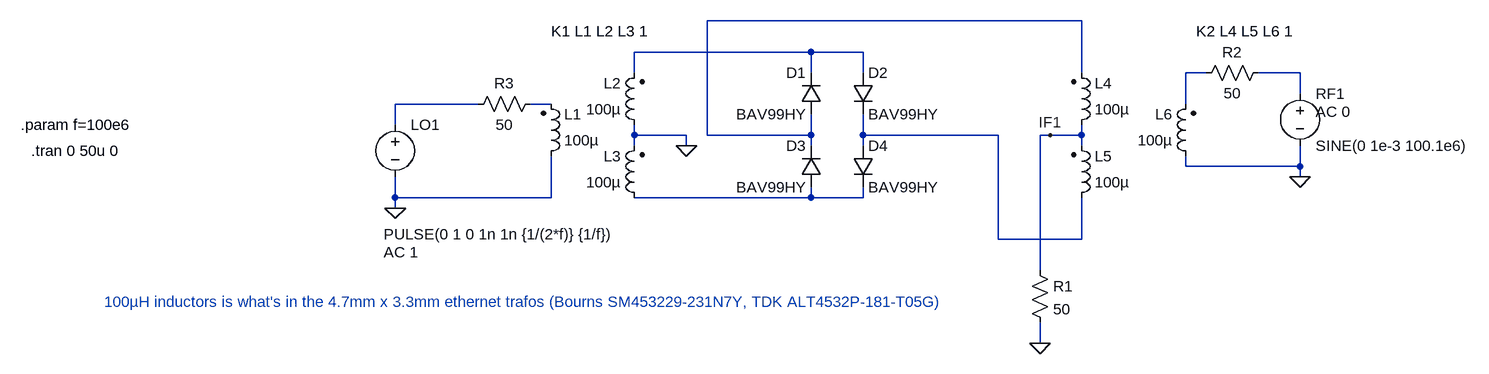
[diagram p0: schematic ethernet_mixer.asc]
ethernet_mixer.asc, the LTspice schematic file:
Version 4
SHEET 1 1112 680
WIRE 496 -320 -80 -320
WIRE 80 -272 -192 -272
WIRE 160 -272 80 -272
WIRE -192 -240 -192 -272
WIRE 80 -240 80 -272
WIRE 160 -240 160 -272
WIRE 496 -240 496 -320
WIRE 688 -240 656 -240
WIRE 832 -240 768 -240
WIRE 832 -208 832 -240
WIRE -432 -192 -560 -192
WIRE -320 -192 -352 -192
WIRE 656 -192 656 -240
WIRE -560 -160 -560 -192
WIRE -192 -144 -192 -160
WIRE -112 -144 -192 -144
WIRE -80 -144 -80 -320
WIRE 80 -144 80 -176
WIRE 80 -144 -80 -144
WIRE 160 -144 160 -176
WIRE 368 -144 160 -144
WIRE 448 -144 432 -144
WIRE 496 -144 496 -160
WIRE 496 -144 448 -144
WIRE -192 -128 -192 -144
WIRE -112 -128 -112 -144
WIRE 80 -128 80 -144
WIRE 160 -128 160 -144
WIRE 496 -128 496 -144
WIRE 656 -96 656 -112
WIRE 832 -96 832 -128
WIRE 832 -96 656 -96
WIRE 832 -80 832 -96
WIRE -560 -48 -560 -80
WIRE -320 -48 -320 -112
WIRE -320 -48 -560 -48
WIRE 80 -48 80 -64
WIRE 80 -48 -192 -48
WIRE 160 -48 160 -64
WIRE 160 -48 80 -48
WIRE -560 -32 -560 -48
WIRE 368 16 368 -144
WIRE 496 16 496 -48
WIRE 496 16 368 16
WIRE 432 64 432 -144
WIRE 432 176 432 144
FLAG -112 -128 0
FLAG -560 -32 0
FLAG 832 -80 0
FLAG 432 176 0
FLAG 448 -144 IF1
SYMBOL voltage -560 -176 R0
WINDOW 3 -18 184 Left 2
WINDOW 123 -18 212 Left 2
WINDOW 39 0 0 Left 0
SYMATTR Value PULSE(0 1 0 1n 1n {1/(2*f)} {1/f})
SYMATTR Value2 AC 1
SYMATTR InstName LO1
SYMBOL ind2 -336 -96 M180
WINDOW 0 36 80 Left 2
WINDOW 3 36 40 Left 2
SYMATTR InstName L1
SYMATTR Value 100µ
SYMATTR Type ind
SYMBOL ind2 -176 -144 R180
WINDOW 0 36 80 Left 2
WINDOW 3 36 40 Left 2
SYMATTR InstName L2
SYMATTR Value 100µ
SYMATTR Type ind
SYMBOL ind2 -176 -32 R180
WINDOW 0 36 80 Left 2
WINDOW 3 36 40 Left 2
SYMATTR InstName L3
SYMATTR Value 100µ
SYMATTR Type ind
SYMBOL ind2 480 -144 M180
WINDOW 0 36 80 Left 2
WINDOW 3 36 40 Left 2
SYMATTR InstName L4
SYMATTR Value 100µ
SYMATTR Type ind
SYMBOL ind2 480 -32 M180
WINDOW 0 36 80 Left 2
WINDOW 3 36 40 Left 2
SYMATTR InstName L5
SYMATTR Value 100µ
SYMATTR Type ind
SYMBOL ind2 672 -96 R180
WINDOW 0 36 80 Left 2
WINDOW 3 36 40 Left 2
SYMATTR InstName L6
SYMATTR Value 100µ
SYMATTR Type ind
SYMBOL diode 96 -176 R180
WINDOW 0 24 64 Left 2
WINDOW 3 24 0 Left 2
SYMATTR InstName D1
SYMATTR Value BAV99HY
SYMBOL voltage 832 -224 R0
WINDOW 123 24 44 Left 2
WINDOW 39 24 124 Left 2
SYMATTR Value2 AC 0
SYMATTR InstName RF1
SYMATTR Value SINE(0 1e-3 100.1e6)
SYMBOL res 416 48 R0
SYMATTR InstName R1
SYMATTR Value 50
SYMBOL diode 144 -240 R0
SYMATTR InstName D2
SYMATTR Value BAV99HY
SYMBOL res 784 -256 R90
WINDOW 0 0 56 VBottom 2
WINDOW 3 32 56 VTop 2
SYMATTR InstName R2
SYMATTR Value 50
SYMBOL res -336 -208 R90
WINDOW 0 0 56 VBottom 2
WINDOW 3 32 56 VTop 2
SYMATTR InstName R3
SYMATTR Value 50
SYMBOL diode 96 -64 R180
WINDOW 0 24 64 Left 2
WINDOW 3 24 0 Left 2
SYMATTR InstName D3
SYMATTR Value BAV99HY
SYMBOL diode 144 -128 R0
SYMATTR InstName D4
SYMATTR Value BAV99HY
TEXT -320 -304 Left 2 !K1 L1 L2 L3 1
TEXT 672 -304 Left 2 !K2 L4 L5 L6 1
TEXT -1136 -160 Left 2 !.param f=100e6
TEXT -1120 -120 Left 2 !.tran 0 50u 0
TEXT -1008 112 Left 2 ;100µH inductors is what's in the 4.7mm x 3.3mm ethernet trafos (Bourns SM453229-231N7Y, TDK ALT4532P-181-T05G)

The netlist it stands for:
* ethernet_mixer.asc
V§LO1 N005 0 PULSE(0 1 0 1n 1n {1/(2*f)} {1/f}) AC 1
L1 0 N006 100µ
L2 0 N002 100µ
L3 N008 0 100µ
L4 IF1 N001 100µ
L5 N007 IF1 100µ
L6 0 N003 100µ
D1 N001 N002 BAV99HY
V§RF1 N004 0 SINE(0 1e-3 100.1e6) AC 0
R1 IF1 0 50
D2 N002 N007 BAV99HY
R2 N004 N003 50
R3 N006 N005 50
D3 N008 N001 BAV99HY
D4 N007 N008 BAV99HY
.model D D
.lib standard.dio
K1 L1 L2 L3 1
K2 L4 L5 L6 1
.param f=100e6
.tran 0 50u 0
* 100µH inductors is what's in the 4.7mm x 3.3mm ethernet trafos (Bourns SM453229-231N7Y, TDK ALT4532P-181-T05G)
.backanno
.end